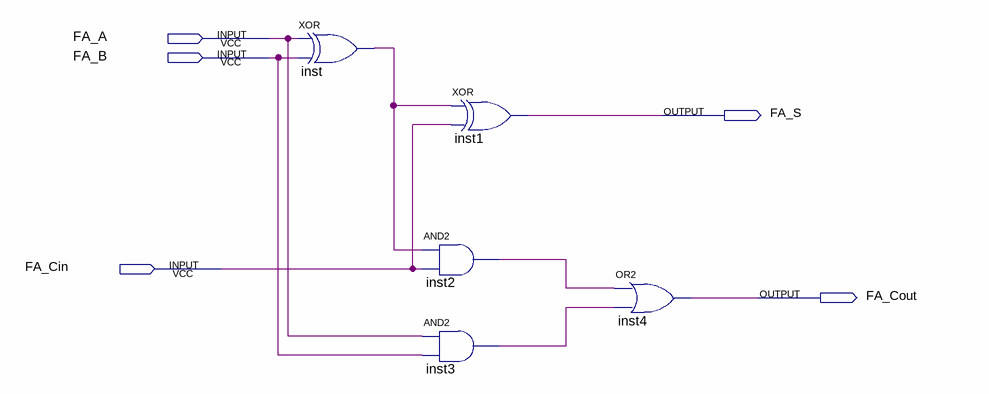
[diagram p0: schematic sheet]
// Quartus schematic FullAdder.bdf as structural Verilog: 5 symbols, 5 pins
module FullAdder (
  input  FA_A,
  input  FA_B,
  input  FA_Cin,
  output FA_S,
  output FA_Cout
);

  wire inst2_out, inst3_out, inst_out;

  xor inst (inst_out, FA_A, FA_B);
  xor inst1 (FA_S, inst_out, FA_Cin);
  and inst2 (inst2_out, inst_out, FA_Cin);
  and inst3 (inst3_out, FA_A, FA_B);
  or inst4 (FA_Cout, inst2_out, inst3_out);
endmodule
